# EAGLE design Battery Gauge LED Board (EAGLE 6.4)
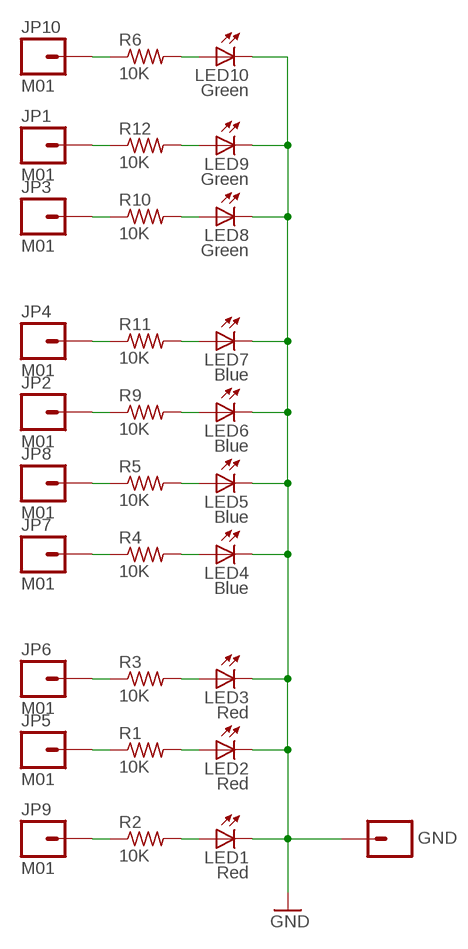
[diagram p0: schematic, sheet 1]

## Parts
GND  M01  [1X01_SMD_SM]
JP1  M01  [1X01_SMD_SM]
JP2  M01  [1X01_SMD_SM]
JP3  M01  [1X01_SMD_SM]
JP4  M01  [1X01_SMD_SM]
JP5  M01  [1X01_SMD_SM]
JP6  M01  [1X01_SMD_SM]
JP7  M01  [1X01_SMD_SM]
JP8  M01  [1X01_SMD_SM]
JP9  M01  [1X01_SMD_SM]
JP10  M01  [1X01_SMD_SM]
LED1  Red  LED1206_SLIM  [CHIPLED_1206_SLIM]
LED2  Red  LED1206_SLIM  [CHIPLED_1206_SLIM]
LED3  Red  LED1206_SLIM  [CHIPLED_1206_SLIM]
LED4  Blue  LED1206_SLIM  [CHIPLED_1206_SLIM]
LED5  Blue  LED1206_SLIM  [CHIPLED_1206_SLIM]
LED6  Blue  LED1206_SLIM  [CHIPLED_1206_SLIM]
LED7  Blue  LED1206_SLIM  [CHIPLED_1206_SLIM]
LED8  Green  LED1206_SLIM  [CHIPLED_1206_SLIM]
LED9  Green  LED1206_SLIM  [CHIPLED_1206_SLIM]
LED10  Green  LED1206_SLIM  [CHIPLED_1206_SLIM]
R1  10K  R-US_R0805_2  [R0805_2]
R2  10K  R-US_R0805_2  [R0805_2]
R3  10K  R-US_R0805_2  [R0805_2]
R4  10K  R-US_R0805_2  [R0805_2]
R5  10K  R-US_R0805_2  [R0805_2]
R6  10K  R-US_R0805_2  [R0805_2]
R9  10K  R-US_R0805_2  [R0805_2]
R10  10K  R-US_R0805_2  [R0805_2]
R11  10K  R-US_R0805_2  [R0805_2]
R12  10K  R-US_R0805_2  [R0805_2]

## Nets
GND: GND.P$1 LED1.C LED2.C LED3.C LED4.C LED5.C LED6.C LED7.C LED8.C LED9.C LED10.C
N$1: LED2.A R1.2
N$2: LED3.A R3.2
N$3: JP1.P$1 R12.1
N$4: JP2.P$1 R9.1
N$5: LED4.A R4.2
N$6: LED5.A R5.2
N$7: JP3.P$1 R10.1
N$8: LED6.A R9.2
N$9: LED8.A R10.2
N$10: LED7.A R11.2
N$11: LED9.A R12.2
N$12: JP4.P$1 R11.1
N$13: JP5.P$1 R1.1
N$14: JP6.P$1 R3.1
N$15: JP7.P$1 R4.1
N$16: JP8.P$1 R5.1
N$18: LED1.A R2.2
N$19: JP9.P$1 R2.1
N$20: LED10.A R6.2
N$21: JP10.P$1 R6.1

## Library data of the parts
GND JP1-JP10 = SparkFun:M01: Header 1 Standard 1-pin 0.1" header. Use with straight break away headers (SKU : PRT-00116), right angle break away headers (PRT-00553), swiss pins (PRT-00743), machine pins (PRT-00117), and female headers (PRT-00115).
LED1-LED10 = adafruit:LED: LED OSRAM: - CHIPLED LG R971, LG N971, LY N971, LG Q971, LY Q971, LO R971, LY R971 LH N974, LH R974 LS Q976, LO Q976, LY Q976 LO Q996 - Hyper CHIPLED LW Q18S LB Q993, LB Q99A, LB R99A - SideLED LS A670, LO A670, LY A670, LG A670, LP A670 LB A673, LV A673, LT A673, LW A673 LH A674 LY A675 LS A676, LA A676, LO A676, LY A676, LW A676 LS A679, LY A679, LG A679 - Hyper Micro SIDELED® LS Y876, LA Y876, LO Y876, LY Y876 LT Y87S - SmartLED LW L88C, LW L88S LB L89C, LB L89S, LG L890 LS L89K, LO L89K, LY L89K LS L896, LA L896, LO L896, LY L896 - TOPLED LS T670, LO T670, LY T670, LG T670, LP T670 LSG T670, LSP T670, LSY T670, LOP T670, LYG T670 LG T671, LOG T671, LSG T671 LB T673, LV T673, LT T673, LW T673 LH T674 LS T676, LA T676, LO T676, LY T676, LB T676, LH T676, LSB T676, LW T676 LB T67C, LV T67C, LT T67C, LS T67K, LO T67K, LY T67K, LW E67C LS E67B, LA E67B, LO E67B, LY E67B, LB E67C, LV E67C, LT E67C LW T67C LS T679, LY T679, LG T679 LS T770, LO T770, LY T770, LG T770, LP T770 LB T773, LV T773, LT T773, LW T773 LH T774 LS E675, LA E675, LY E675, LS T675 LS T776, LA T776, LO T776, LY T776, LB T776 LHGB T686 LT T68C, LB T68C - Hyper Mini TOPLED® LB M676 - Mini TOPLED Santana® LG M470 LS M47K, LO M47K, LY M47K Source: http://www.osram.convergy.de/
R1-R6 R9-R12 = adafruit:R-US_: RESISTOR, American symbol

## Board
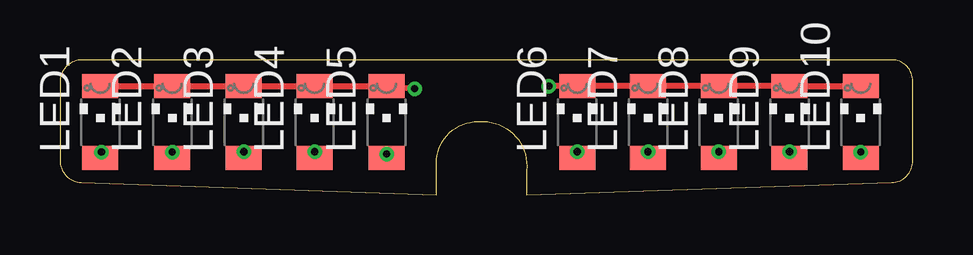
[diagram p1: board, top side]
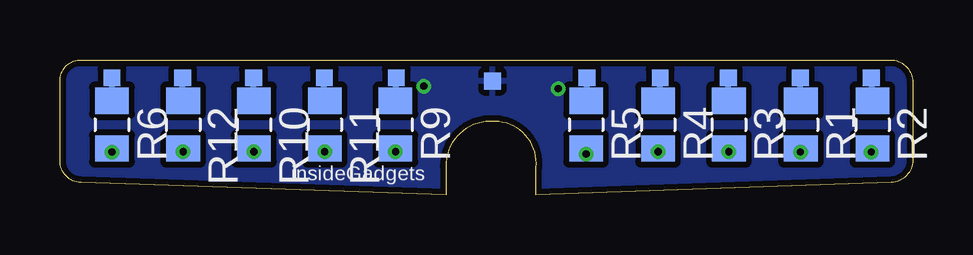
[diagram p2: board, bottom side, seen from below]

Size 35.55 x 5.63 mm. Coordinates in mm from the lower left corner, seen from the top.
Outline: 19.45,0 34.67,0.51 arc88 35.55,1.42 35.55,4.76 arc90 34.68,5.63 0.93,5.63 arc90 0,4.7 0,1.44 arc88 0.89,0.52 15.7,0 15.7,1.15 arc-90 17.25,3.05 17.82,3.05 arc-90 19.45,1.02 19.45,0
Copper layers (1*16): Top 0.035mm / dielectric 1.5mm / Bottom 0.035mm
Design rules "ITEADstudio_DRC": minimum track width 6mil, minimum drill 12mil, track to track 6mil, track to pad 6mil, pad to pad 6mil, via to via 6mil, smd to smd 0mil, copper to edge 10mil, drill to drill 10mil, minimum pad ring 10mil, minimum via ring 6mil, stop-mask expansion 2mil, vias tented up to drill 100mil, thermal gap 10mil

### Footprints (pad centres in the part's own frame; a part is rotated, then mirrored left to right if it is on the bottom)
1X01_SMD_SM = smd 0.7 x 0.7: P$1 0,0
CHIPLED_1206_SLIM = smd 1.5 x 1: A 0,-1.5; C 0,1.5
R0805_2 = smd 1.1 x 1.4: 1 -1,0; 2 1,0

### Placement (x,y rotation side)
GND  17.52,4.75 180 bottom
JP1  30.43,4.88 0 bottom
JP2  21.53,4.88 0 bottom
JP3  27.48,4.88 0 bottom
JP4  24.53,4.88 0 bottom
JP5  4.68,4.88 0 bottom
JP6  7.68,4.88 0 bottom
JP7  10.53,4.88 0 bottom
JP8  13.58,4.88 0 bottom
JP9  1.73,4.88 0 bottom
JP10  33.38,4.88 0 bottom
LED1  1.68,3.03 0 top
LED2  4.68,3.03 0 top
LED3  7.67,3.03 0 top
LED4  10.62,3.03 0 top
LED5  13.62,3.03 0 top
LED6  21.57,3.03 0 top
LED7  24.52,3.03 0 top
LED8  27.47,3.03 0 top
LED9  30.42,3.03 0 top
LED10  33.38,3.03 0 top
R1  4.67,2.93 270 bottom
R2  1.68,2.93 270 bottom
R3  7.67,2.93 270 bottom
R4  10.62,2.93 270 bottom
R5  13.62,2.93 270 bottom
R6  33.38,2.93 270 bottom
R9  21.57,2.93 270 bottom
R10  27.47,2.93 270 bottom
R11  24.52,2.93 270 bottom
R12  30.42,2.93 270 bottom

### Tracks (layer width: path | path; a pad name or v marks a point on that pad's centre or on a via)
GND  (via drill 0.3)
  Top 0.254: LED10.C LED9.C LED8.C LED7.C LED6.C v20.38,4.53 | LED1.C LED2.C LED3.C LED4.C LED5.C v14.78,4.43
  pour Bottom (isolate 0.254): -13.97,11.98 48.08,10.33 49.58,-4.42 -19.27,-3.42
N$1  (via drill 0.3)
  Top 0.254: LED2.A v4.68,1.78
  Bottom 0.254: v4.68,1.78 4.68,1.81 R1.2
N$2  (via drill 0.3)
  Top 0.254: LED3.A v7.67,1.8
  Bottom 0.254: v7.67,1.8 R3.2
N$3
  Bottom 0.254: R12.1 30.43,3.93 JP1.P$1
N$4
  Bottom 0.254: R9.1 21.53,3.93 JP2.P$1
N$5  (via drill 0.3)
  Top 0.254: LED4.A v10.62,1.8
  Bottom 0.254: v10.62,1.8 R4.2
N$6  (via drill 0.3)
  Top 0.254: LED5.A v13.62,1.7
  Bottom 0.254: v13.62,1.7 R5.2
N$7
  Bottom 0.254: R10.1 27.48,3.93 JP3.P$1
N$8  (via drill 0.3)
  Top 0.254: LED6.A v21.57,1.8
  Bottom 0.254: v21.57,1.8 R9.2
N$9  (via drill 0.3)
  Top 0.254: LED8.A v27.47,1.8
  Bottom 0.254: v27.47,1.8 R10.2
N$10  (via drill 0.3)
  Top 0.254: LED7.A v24.52,1.8
  Bottom 0.254: v24.52,1.8 R11.2
N$11  (via drill 0.3)
  Top 0.254: LED9.A v30.42,1.8
  Bottom 0.254: v30.42,1.8 R12.2
N$12
  Bottom 0.254: R11.1 24.53,3.93 JP4.P$1
N$13
  Bottom 0.254: R1.1 4.68,3.93 JP5.P$1
N$14
  Bottom 0.254: R3.1 7.68,3.93 JP6.P$1
N$15
  Bottom 0.254: R4.1 10.53,3.93 JP7.P$1
N$16
  Bottom 0.254: R5.1 13.58,3.93 JP8.P$1
N$18  (via drill 0.3)
  Top 0.254: LED1.A 1.73,1.53 v1.73,1.78
  Bottom 0.406: v1.73,1.78 1.68,1.78 R2.2
N$19
  Bottom 0.254: R2.1 JP9.P$1
N$20  (via drill 0.3)
  Top 0.254: LED10.A v33.38,1.78
  Bottom 0.254: v33.38,1.78 R6.2
N$21
  Bottom 0.254: R6.1 JP10.P$1

### Text on the board
_bsilk: insideGadgets
209bmp: C:/My Downloads/gbabattery/pics/002-2.bmp